# EAGLE design EarCon-initial (EAGLE 9.6.2)
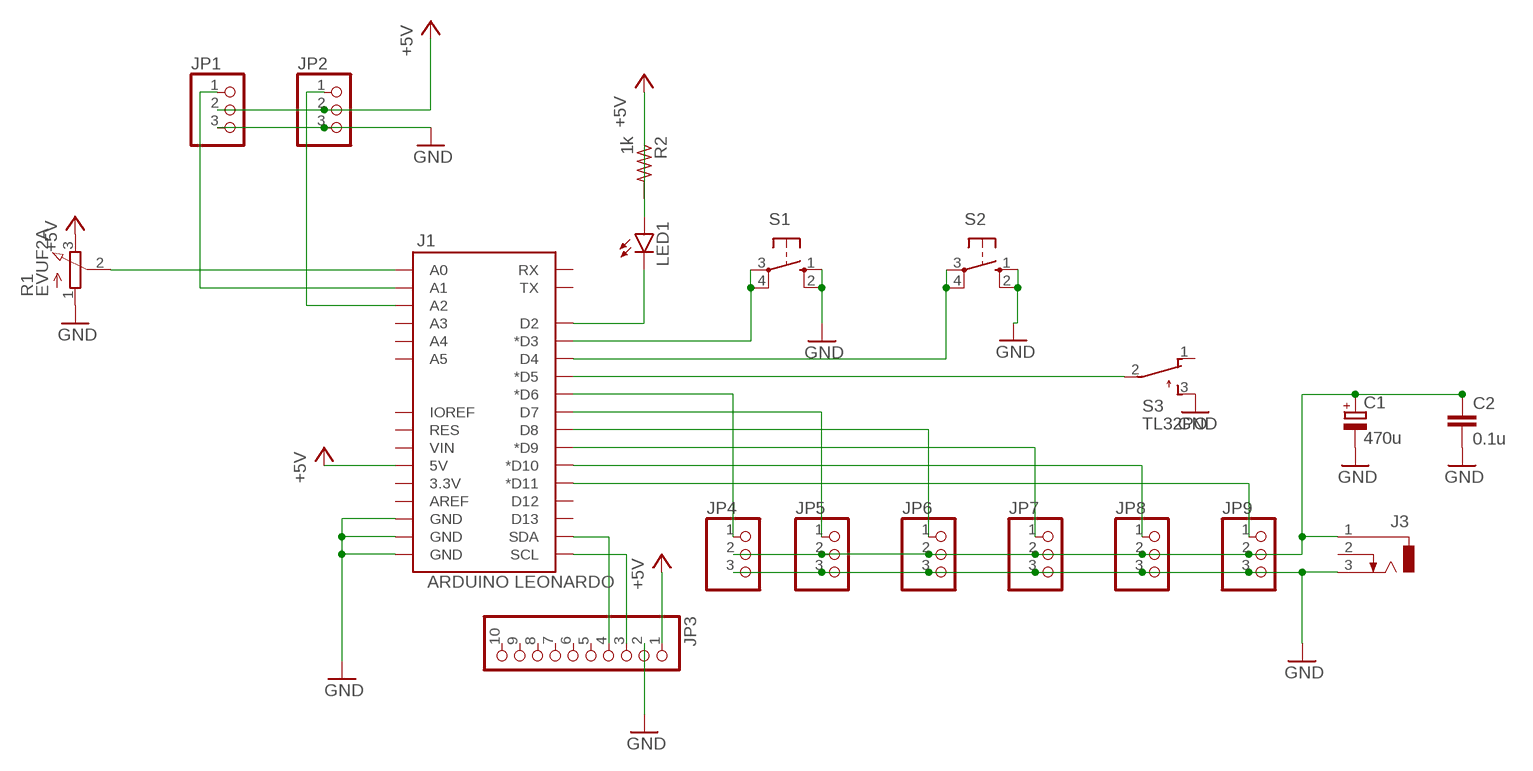
[diagram p0: schematic, sheet 1]

## Parts
C1  470u  CPOL-EUE5-10.5  [E5-10,5]
C2  0.1u  C-EU050-025X075  [C050-025X075]
J1  ARDUINO LEONARDO  ARDUINO_R3_SHIELDNOLABELS  [UNO_R3_SHIELD_NOLABELS]
J3  DCJ0303  [DCJ0303]
JP1  PINHD-1X3  [1X03]
JP2  PINHD-1X3  [1X03]
JP3  PINHD-1X10  [1X10]
JP4  PINHD-1X3  [1X03]
JP5  PINHD-1X3  [1X03]
JP6  PINHD-1X3  [1X03]
JP7  PINHD-1X3  [1X03]
JP8  PINHD-1X3  [1X03]
JP9  PINHD-1X3  [1X03]
LED1  LED5MM  [LED5MM]
R1  EVUF2A  [EVUF]
R2  1k  R-US_0204/7  [0204/7]
S1  10-XX  [B3F-10XX]
S2  10-XX  [B3F-10XX]
S3  TL32PO  [TL3XPO]

## Nets
+5V: J1.5V JP1.2 JP2.2 JP3.1 R1.3(E) R2.2
GND: C1.- C2.2 J1.GND@0(GND) J1.GND@1(GND) J1.GND@2(GND) J3.3 JP1.3 JP2.3 JP3.2 JP4.3 JP5.3 JP6.3 JP7.3 JP8.3 JP9.3 R1.1(A) S1.1(S) S1.2(S1) S2.1(S) S2.2(S1) S3.3(S)
N$1: J1.A0 R1.2(S)
N$2: J1.A1 JP1.1
N$3: J1.A2 JP2.1
N$4: J1.SDA JP3.4
N$5: J1.SCL JP3.3
N$6: J1.D11(*D11) JP9.1
N$7: J1.D10(*D10) JP8.1
N$8: J1.D9(*D9) JP7.1
N$9: J1.D8 JP6.1
N$10: J1.D7 JP5.1
N$11: J1.D6(*D6) JP4.1
N$12: C1.+ C2.1 J3.1 JP4.2 JP5.2 JP6.2 JP7.2 JP8.2 JP9.2
N$13: LED1.A R2.1
N$14: J1.D2 LED1.K(C)
N$15: J1.D3(*D3) S1.3(P) S1.4(P1)
N$16: J1.D4 S2.3(P) S2.4(P1)
N$17: J1.D5(*D5) S3.2(P)
Unconnected: J1.3.3V J1.A3 J1.A4 J1.A5 J1.AREF J1.D12 J1.D13 J1.IOREF J1.RES J1.RX J1.TX J1.VIN J3.2 JP3.5 JP3.6 JP3.7 JP3.8 JP3.9 JP3.10 S3.1(O)

## Library data of the parts
C1 = rcl:CPOL-EU: POLARIZED CAPACITOR, European symbol; SPICEPREFIX: C
C2 = rcl:C-EU: CAPACITOR, European symbol; SPICEPREFIX: C
J1 = SparkFun-Boards:ARDUINO_R3_SHIELD: Shield form compatible with the Arduino Uno R3.
J3 = con-jack:DCJ0303: DC POWER JACK Source: DCJ0303.pdf; OC_FARNELL: unknown; OC_NEWARK: unknown
JP1 JP2 JP4-JP9 = pinhead:PINHD-1X3: PIN HEADER
JP3 = pinhead:PINHD-1X10: PIN HEADER
LED1 = led:LED: LED OSRAM: - CHIPLED LG R971, LG N971, LY N971, LG Q971, LY Q971, LO R971, LY R971 LH N974, LH R974 LS Q976, LO Q976, LY Q976 LO Q996 - Hyper CHIPLED LW Q18S LB Q993, LB Q99A, LB R99A - SideLED LS A670, LO A670, LY A670, LG A670, LP A670 LB A673, LV A673, LT A673, LW A673 LH A674 LY A675 LS A676, LA A676, LO A676, LY A676, LW A676 LS A679, LY A679, LG A679 - Hyper Micro SIDELED® LS Y876, LA Y876, LO Y876, LY Y876 LT Y87S - SmartLED LW L88C, LW L88S LB L89C, LB L89S, LG L890 LS L89K, LO L89K, LY L89K LS L896, LA L896, LO L896, LY L896 - TOPLED LS T670, LO T670, LY T670, LG T670, LP T670 LSG T670, LSP T670, LSY T670, LOP T670, LYG T670 LG T671, LOG T671, LSG T671 LB T673, LV T673, LT T673, LW T673 LH T674 LS T676, LA T676, LO T676, LY T676, LB T676, LH T676, LSB T676, LW T676 LB T67C, LV T67C, LT T67C, LS T67K, LO T67K, LY T67K, LW E67C LS E67B, LA E67B, LO E67B, LY E67B, LB E67C, LV E67C, LT E67C LW T67C LS T679, LY T679, LG T679 LS T770, LO T770, LY T770, LG T770, LP T770 LB T773, LV T773, LT T773, LW T773 LH T774 LS E675, LA E675, LY E675, LS T675 LS T776, LA T776, LO T776, LY T776, LB T776 LHGB T686 LT T68C, LB T68C - Hyper Mini TOPLED® LB M676 - Mini TOPLED Santana® LG M470 LS M47K, LO M47K, LY M47K Source: http://www.osram.convergy.de LUXEON: - LUMILED® LXK2-PW12-R00, LXK2-PW12-S00, LXK2-PW14-U00, LXK2-PW14-V00 LXK2-PM12-R00, LXK2-PM12-S00, LXK2-PM14-U00 LXK2-PE12-Q00, LXK2-PE12-R00, LXK2-PE12-S00, LXK2-PE14-T00, LXK2-PE14-U00 LXK2-PB12-K00, LXK2-PB12-L00, LXK2-PB12-M00, LXK2-PB14-N00, LXK2-PB14-P00, LXK2-PB14-Q00 LXK2-PR12-L00, LXK2-PR12-M00, LXK2-PR14-Q00, LXK2-PR14-R00 LXK2-PD12-Q00, LXK2-PD12-R00, LXK2-PD12-S00 LXK2-PH12-R00, LXK2-PH12-S00 LXK2-PL12-P00, LXK2-PL12-Q00, LXK2-PL12-R00 Source: www.luxeon.com KINGBRIGHT: KA-3528ASYC Source: www.kingbright.com
R1 = pot:EVU: 9 mm Square Rotary Potentiometers Source: Panasonic
R2 = rcl:R-US_: RESISTOR, American symbol; SPICEPREFIX: R
S1 S2 = switch-omron:10-XX: OMRON SWITCH; MPN: B3F-1000; OC_FARNELL: 176432; OC_NEWARK: 36M3542
S3 = switch:TL32PO: TINY SWITCH ON - MOM Source: http://www2.produktinfo.conrad.com/datenblaetter/700000-724999/705152-da-01-de-Subminiaturschalter_TL_36YO.pdf

## Net classes
0 Default: width 0.406 mm, clearance 0.406 mm

## Board
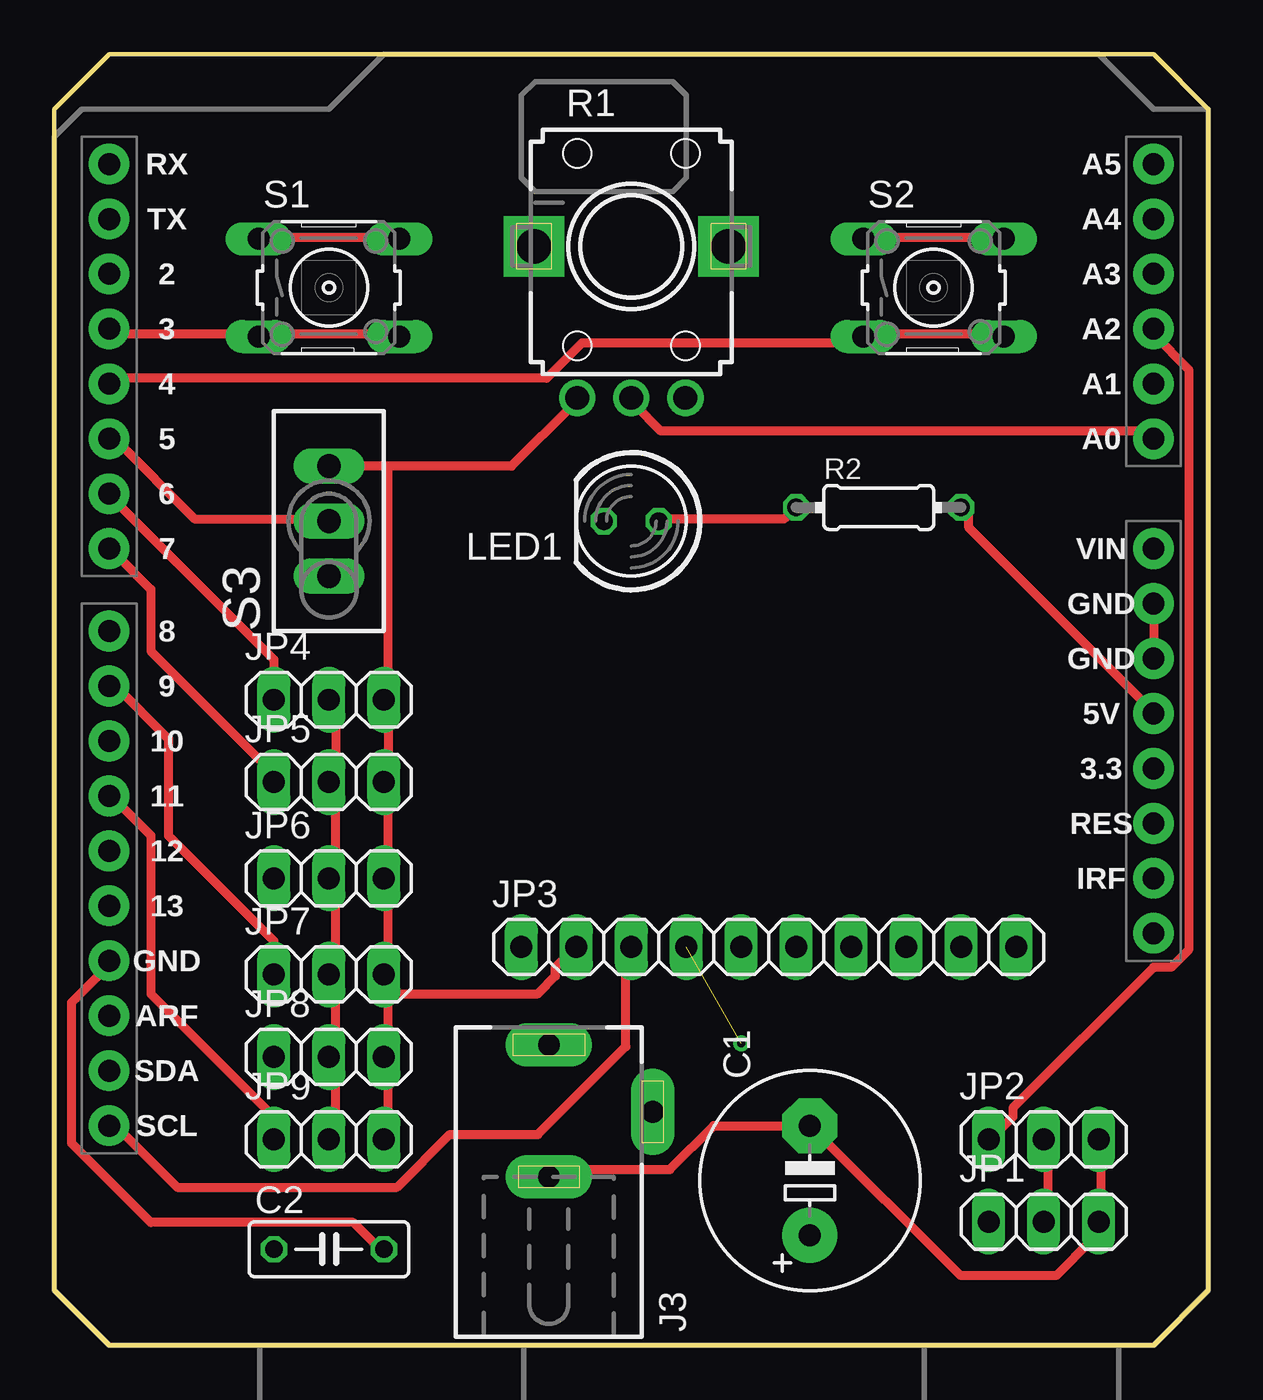
[diagram p1: board, top side]
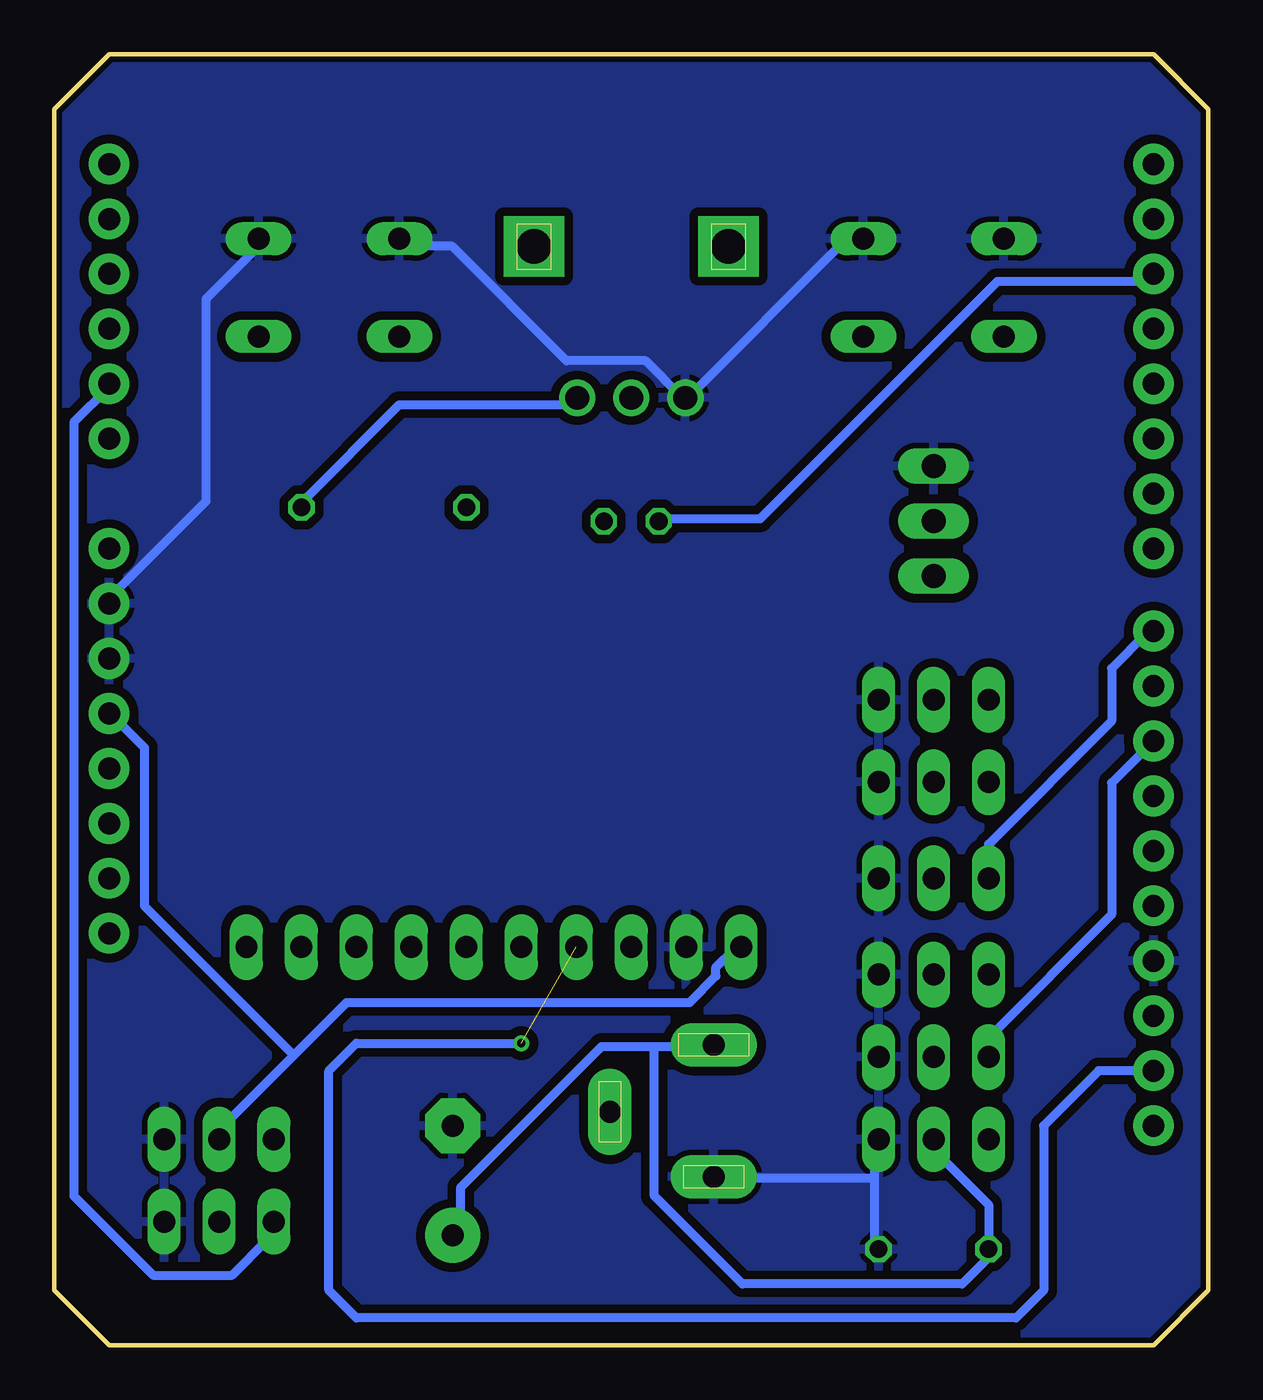
[diagram p2: board, bottom side, seen from below]

Size 53.34 x 59.69 mm. Coordinates in mm from the lower left corner, seen from the top.
Outline: 53.34,2.54 53.34,57.15 50.8,59.69 2.54,59.69 0,57.15 0,2.54 2.54,0 50.8,0 53.34,2.54
Copper layers (1*16): Top 0.035mm / dielectric 1.5mm / Bottom 0.035mm
Design rules "SparkFun-2-layer-TIGHT *": minimum track width 10mil, minimum drill 15mil, track to track 10mil, track to pad 10mil, pad to pad 10mil, via to via 10mil, smd to smd 10mil, copper to edge 10mil, drill to drill 10mil, minimum pad ring 7mil, minimum via ring 7mil, stop-mask expansion 4mil, vias tented up to drill 25mil, thermal gap 10mil

### Footprints (pad centres in the part's own frame; a part is rotated, then mirrored left to right if it is on the bottom)
E5-10,5 = drill 1.016 pad 2.54: + -2.54,0 | drill 1.016 pad 2.54 octagon: - 2.54,0
C050-025X075 = drill 0.813 octagon: 1 -2.54,0; 2 2.54,0
UNO_R3_SHIELD_NOLABELS = drill 1.016 pad 1.88: 3.3V 50.8,26.67; 5V 50.8,29.21; A0 50.8,41.91; A1 50.8,44.45; A2 50.8,46.99; A3 50.8,49.53; A4 50.8,52.07; A5 50.8,54.61; AREF 2.54,15.24; D2 2.54,49.53; D3 2.54,46.99; D4 2.54,44.45; D5 2.54,41.91; D6 2.54,39.37; D7 2.54,36.83; D8 2.54,33.02; D9 2.54,30.48; D10 2.54,27.94; D11 2.54,25.4; D12 2.54,22.86; D13 2.54,20.32; GND@0 50.8,31.75; GND@1 50.8,34.29; GND@2 2.54,17.78; IOREF 50.8,21.59; NC 50.8,19.05; RES 50.8,24.13; RX 2.54,54.61; SCL 2.54,10.16; SDA 2.54,12.7; TX 2.54,52.07; VIN 50.8,36.83
DCJ0303 = drill 1 pad 2 long: 1 0,3.1; 2 4.8,0; 3 0,-3
1X03 = drill 1.016 long: 1 -2.54,0; 2 0,0; 3 2.54,0
1X10 = drill 1.016 long: 1 -11.43,0; 2 -8.89,0; 3 -6.35,0; 4 -3.81,0; 5 -1.27,0; 6 1.27,0; 7 3.81,0; 8 6.35,0; 9 8.89,0; 10 11.43,0
LED5MM = drill 0.813 octagon: A -1.27,0; K 1.27,0
EVUF = drill 1.1 pad 1.676: 1 -2.5,-7; 2 0,-7; 3 2.5,-7 | drill 1.6 pad 2.8 square: M1 4.5,0; M2 -4.5,0
0204/7 = drill 0.813 octagon: 1 -3.81,0; 2 3.81,0
B3F-10XX = drill 1.016 long: 1 -3.251,2.261; 2 3.251,2.261; 3 -3.251,-2.261; 4 3.251,-2.261
TL3XPO = drill 1.1 pad 1.422 long: 1 -2.54,0; 2 0,0; 3 2.54,0

### Placement (x,y rotation side)
C1  34.92,7.62 90 top
C2  12.7,4.45 0 top
J1  0,0 0 top
J3  22.86,10.79 0 top
JP1  45.72,5.71 0 top
JP2  45.72,9.53 0 top
JP3  33.02,18.41 0 top
JP4  12.7,29.84 0 top
JP5  12.7,26.04 0 top
JP6  12.7,21.59 0 top
JP7  12.7,17.14 0 top
JP8  12.7,13.34 0 top
JP9  12.7,9.53 0 top
LED1  26.67,38.1 180 top
R1  26.67,50.8 0 top
R2  38.1,38.73 0 top
S1  12.7,48.9 0 top
S2  40.64,48.9 0 top
S3  12.7,38.1 90 top

### Tracks (layer width: path | path; a pad name or v marks a point on that pad's centre or on a via)
+5V
  Top 0.406: JP1.2 45.92,6.1 45.92,9.35 JP2.2 | R2.2 42.27,38.61 42.27,37.8 50.8,29.26 J1.5V
  Bottom 0.406: 42.27,13.41 45.92,9.75 JP2.2 | 42.27,13.41 39.83,15.85 23.98,15.85 22.76,17.07 22.76,17.48 21.95,18.29 JP3.1 | R1.3 29.26,43.48 37.39,43.48 41.86,39.01 R2.2 | 42.27,13.41 49.17,20.32 49.17,27.64 50.8,29.26 J1.5V
GND
  Top 0.406: J1.GND@1 J1.GND@0 | S2.1 37.39,51.21 43.89,51.21 S2.2 | S1.1 9.75,51.21 15.85,51.21 S1.2 | 15.44,40.64 21.13,40.64 23.98,43.48 R1.1 | 15.44,40.64 S3.3 | JP2.3 48.36,9.35 48.36,6.1 JP1.3 47.95,5.69 47.95,4.88 46.33,3.25 41.86,3.25 34.95,10.16 C1.- 30.48,10.16 28.45,8.13 23.16,8.13 J3.3 | JP9.3 15.44,9.75 15.44,13.01 JP8.3 15.44,13.41 15.44,16.26 | 15.44,16.26 15.44,17.07 JP7.3 | JP7.3 15.44,17.48 15.44,21.54 JP6.3 15.44,21.95 15.44,26.01 JP5.3 15.44,26.42 15.44,29.67 JP4.3 15.44,30.07 15.44,40.64 | 15.44,16.26 22.35,16.26 23.16,17.07 23.16,17.48 23.98,18.29 JP3.2 | 15.44,16.26 JP7.3 | J1.GND@2 2.44,17.48 0.81,15.85 0.81,9.35 4.47,5.69 13.82,5.69 15.04,4.47 C2.2
  Bottom 0.406: J1.GND@1 50.8,34.54 46.33,39.01 46.33,48.36 43.89,50.8 S2.2 | S1.2 16.26,50.8 17.07,50.8 23.98,43.89 R1.1 24.38,43.89 26.01,45.52 29.67,45.52 34.95,50.8 37.39,50.8 S2.1 | 15.44,7.72 15.44,9.35 JP9.3 | 15.44,7.72 15.44,4.47 C2.2 | 15.44,7.72 22.76,7.72 J3.3
  pour Bottom: 2.54,60.96 -1.27,57.15 -1.27,1.27 1.27,-1.27 50.8,-1.27 54.61,2.54 54.61,57.15 50.8,60.96
N$1
  Top 0.406: R1.2 26.82,43.48 28.04,42.27 50.8,42.27 J1.A0
N$2
  Bottom 0.406: JP1.1 43.48,5.69 43.48,4.88 45.11,3.25 48.77,3.25 52.43,6.91 52.43,42.67 50.8,44.3 J1.A1
N$3
  Top 0.406: JP2.1 43.48,9.75 44.3,10.57 44.3,10.97 50.8,17.48 51.61,17.48 52.43,18.29 52.43,45.11 50.8,46.74 J1.A2
N$4  (via drill 0.38)  (1 unrouted)
  Bottom 0.406: 2.44,13.01 J1.SDA 5.08,12.7 7.62,10.16 7.62,2.54 8.89,1.27 39.37,1.27 40.64,2.54 40.64,12.7 39.37,13.97 v31.75,13.97
N$5
  Top 0.406: JP3.3 26.42,18.29 26.42,13.82 22.35,9.75 18.29,9.75 15.85,7.32 5.69,7.32 2.85,10.16 J1.SCL
N$6
  Top 0.406: JP9.1 10.16,10.57 4.47,16.26 4.47,23.57 2.85,25.2 J1.D11
N$7
  Bottom 0.406: JP8.1 10.16,14.22 4.47,19.91 4.47,26.01 J1.D10
N$8
  Top 0.406: JP7.1 10.16,18.69 5.28,23.57 5.28,28.04 2.85,30.48 J1.D9
N$9
  Bottom 0.406: JP6.1 10.16,23.16 4.47,28.85 4.47,31.29 2.85,32.92 J1.D8
N$10
  Top 0.406: JP5.1 10.16,26.42 4.47,32.11 4.47,34.95 2.85,36.58 J1.D7
N$11
  Top 0.406: JP4.1 10.16,31.7 2.85,39.01 J1.D6
N$12
  Top 0.406: JP4.2 13.01,29.67 13.01,26.42 JP5.2 13.01,26.01 13.01,21.95 JP6.2 13.01,21.54 13.01,17.48 JP7.2 13.01,17.07 13.01,13.41 JP8.2 13.01,13.01 13.01,9.75 JP9.2
  Bottom 0.406: 25.6,13.82 28.04,13.82 34.54,7.32 34.54,5.28 C1.+ | 25.6,13.82 23.16,13.82 J3.1 | JP9.2 13.01,9.35 10.16,6.5 C2.1 10.16,4.06 11.38,2.85 21.54,2.85 25.6,6.91 25.6,13.82
N$13
  Top 0.406: LED1.A 28.04,38.2 33.73,38.2 34.14,38.61 R2.1
N$14
  Bottom 0.406: LED1.K 25.2,38.2 20.73,38.2 9.75,49.17 2.85,49.17 J1.D2
N$15
  Top 0.406: S1.4 15.85,46.74 9.75,46.74 S1.3 9.35,46.74 2.85,46.74 J1.D3
N$16
  Top 0.406: S2.4 43.89,46.74 37.39,46.74 S2.3 37.39,46.33 24.38,46.33 22.76,44.7 2.85,44.7 J1.D4
N$17
  Top 0.406: S3.2 12.6,38.2 6.5,38.2 2.85,41.86 J1.D5

### Text on the board
tPlace: RX | A5 | TX | A4 | 2 | A3 | 3 | A2 | 4 | A1 | 5 | A0 | 6 | 7 | VIN | GND | 8 | GND | 9 | 5V | 10 | 3.3 | 11 | RES | 12 | IRF | 13 | GND | ARF | SDA | SCL
Measures: Measurements in mm